# EAGLE design YukariII (EAGLE 6.2)
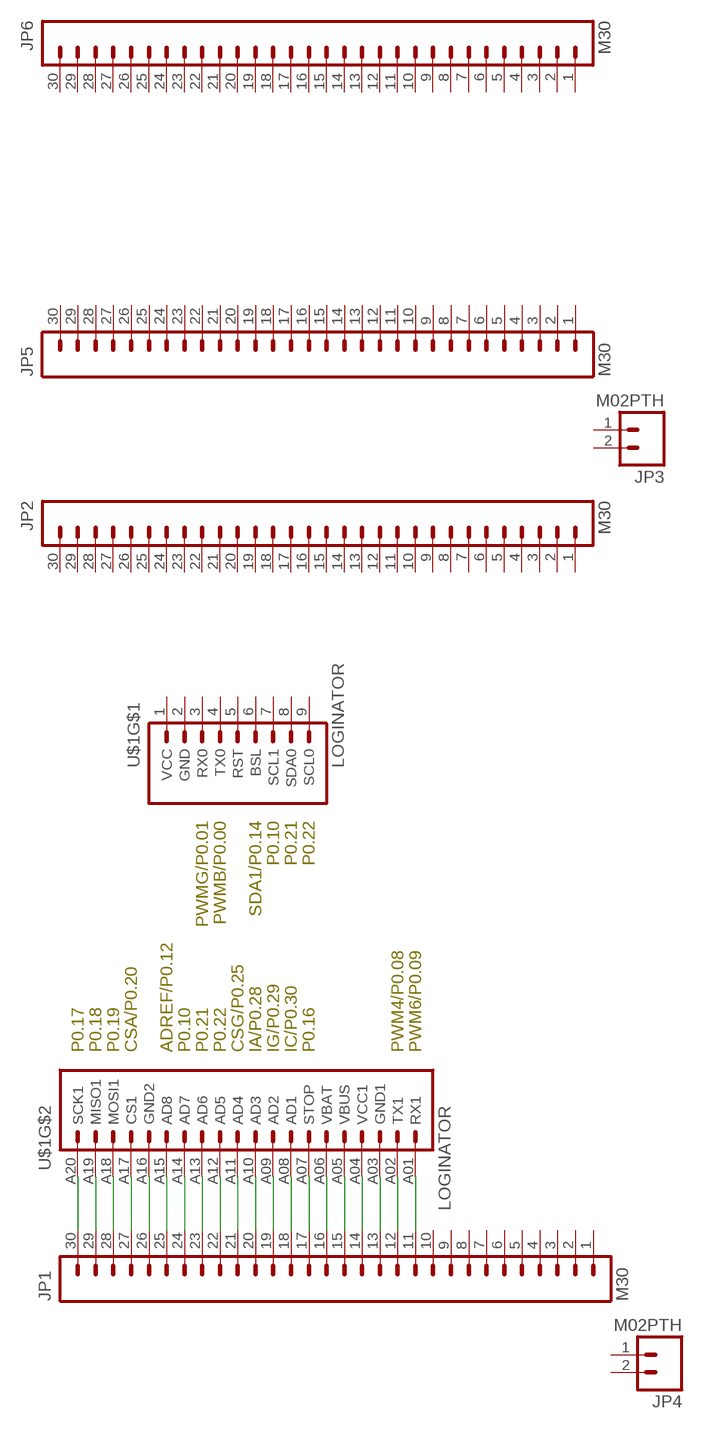
[diagram p0: schematic, sheet 1]

## Parts
JP1  M30  [1X30]
JP2  M30  [1X30]
JP3  M02PTH  [1X02]
JP4  M02PTH  [1X02]
JP5  M30  [1X30]
JP6  M30  [1X30]
U$1  LOGINATOR  [LOGINATOR]

## Nets
N$1: JP1.11 U$1.A01(RX1)
N$2: JP1.12 U$1.A02(TX1)
N$3: JP1.13 U$1.A03(GND1)
N$4: JP1.14 U$1.A04(VCC1)
N$5: JP1.15 U$1.A05(VBUS)
N$6: JP1.16 U$1.A06(VBAT)
N$7: JP1.17 U$1.A07(STOP)
N$8: JP1.18 U$1.A08(AD1)
N$9: JP1.19 U$1.A09(AD2)
N$10: JP1.20 U$1.A10(AD3)
N$11: JP1.21 U$1.A11(AD4)
N$12: JP1.22 U$1.A12(AD5)
N$13: JP1.23 U$1.A13(AD6)
N$14: JP1.24 U$1.A14(AD7)
N$15: JP1.25 U$1.A15(AD8)
N$16: JP1.26 U$1.A16(GND2)
N$17: JP1.27 U$1.A17(CS1)
N$18: JP1.28 U$1.A18(MOSI1)
N$19: JP1.29 U$1.A19(MISO1)
N$20: JP1.30 U$1.A20(SCK1)
Unconnected: JP1.1 JP1.2 JP1.3 JP1.4 JP1.5 JP1.6 JP1.7 JP1.8 JP1.9 JP1.10 JP2.1 JP2.2 JP2.3 JP2.4 JP2.5 JP2.6 JP2.7 JP2.8 JP2.9 JP2.10 JP2.11 JP2.12 JP2.13 JP2.14 JP2.15 JP2.16 JP2.17 JP2.18 JP2.19 JP2.20 JP2.21 JP2.22 JP2.23 JP2.24 JP2.25 JP2.26 JP2.27 JP2.28 JP2.29 JP2.30 JP3.1 JP3.2 JP4.1 JP4.2 JP5.1 JP5.2 JP5.3 JP5.4 JP5.5 JP5.6 JP5.7 JP5.8 JP5.9 JP5.10 JP5.11 JP5.12 JP5.13 JP5.14 JP5.15 JP5.16 JP5.17 JP5.18 JP5.19 JP5.20 JP5.21 JP5.22 JP5.23 JP5.24 JP5.25 JP5.26 JP5.27 JP5.28 JP5.29 JP5.30 JP6.1 JP6.2 JP6.3 JP6.4 JP6.5 JP6.6 JP6.7 JP6.8 JP6.9 JP6.10 JP6.11 JP6.12 JP6.13 JP6.14 JP6.15 JP6.16 JP6.17 JP6.18 JP6.19 JP6.20 JP6.21 JP6.22 JP6.23 JP6.24 JP6.25 JP6.26 JP6.27 JP6.28 JP6.29 JP6.30 U$1.3(RX0) U$1.4(TX0) U$1.5(RST) U$1.6(BSL) U$1.7(SCL1) U$1.8(SDA0) U$1.9(SCL0)

## Power pins joined to a net without a drawn wire
GND: U$1.2(GND)
VCC: U$1.1(VCC)

## Library data of the parts
JP1 JP2 JP5 JP6 = SparkFun-Connectors:M30: 1x30 .1" header
JP3 JP4 = SparkFun-Connectors:M02: Standard 2-pin 0.1" header. Use with - straight break away headers ( PRT-00116) - right angle break away headers (PRT-00553) - swiss pins (PRT-00743) - machine pins (PRT-00117) - female headers (PRT-00115) Molex polarized connector foot print use with: PRT-08233 with associated crimp pins and housings. 2.54_SCREWTERM for use with PRT-10571. 3.5mm Screw Terminal footprints for PRT-08084 5mm Screw Terminal footprints for use with PRT-08433
U$1 = KwanSystems:LOGINATOR

## Net classes
0 default: width 0.152 mm, drill 0.33 mm, clearance 0.152 mm
1 power: width 0.152 mm, drill 0.33 mm, clearance 0.152 mm to class 0, clearance 0.152 mm
2 hv: width 0.152 mm, drill 0.33 mm, clearance 0.152 mm to class 0, clearance 0.152 mm to class 1, clearance 0.152 mm

## Board
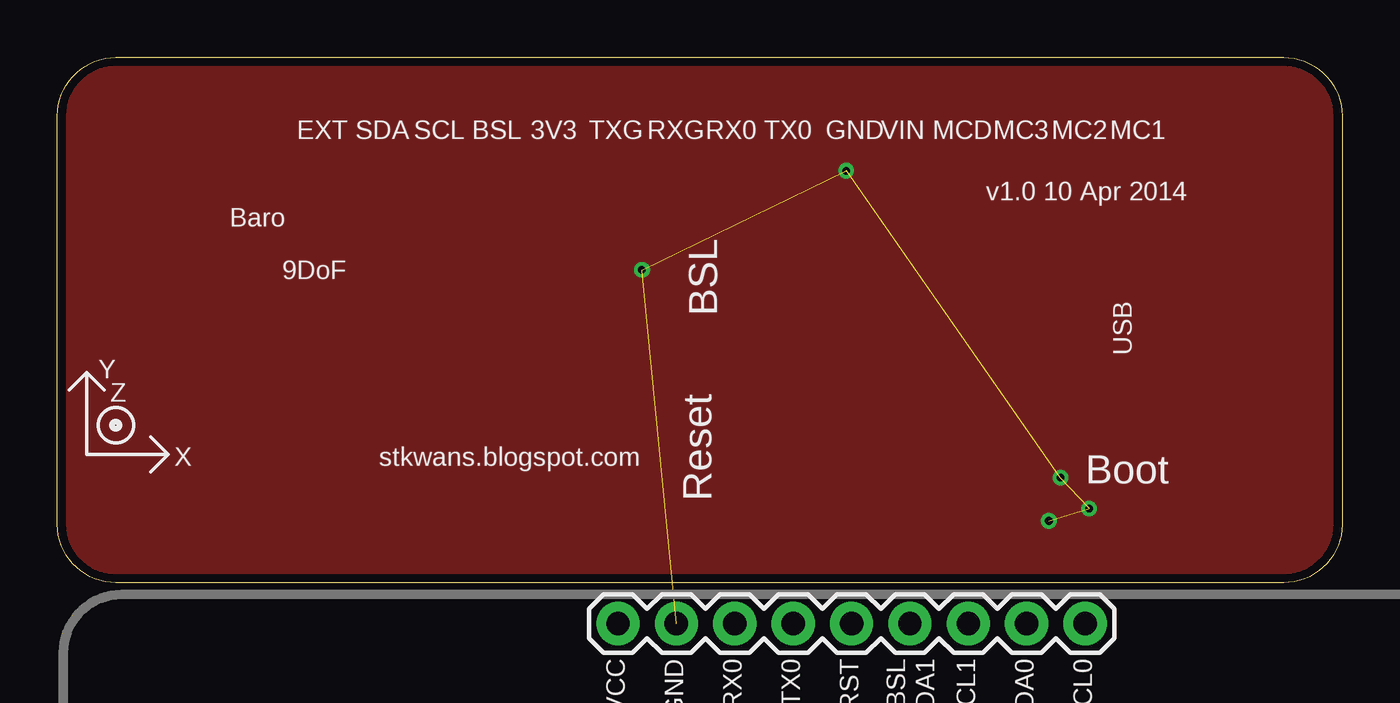
[diagram p1: board, top side]
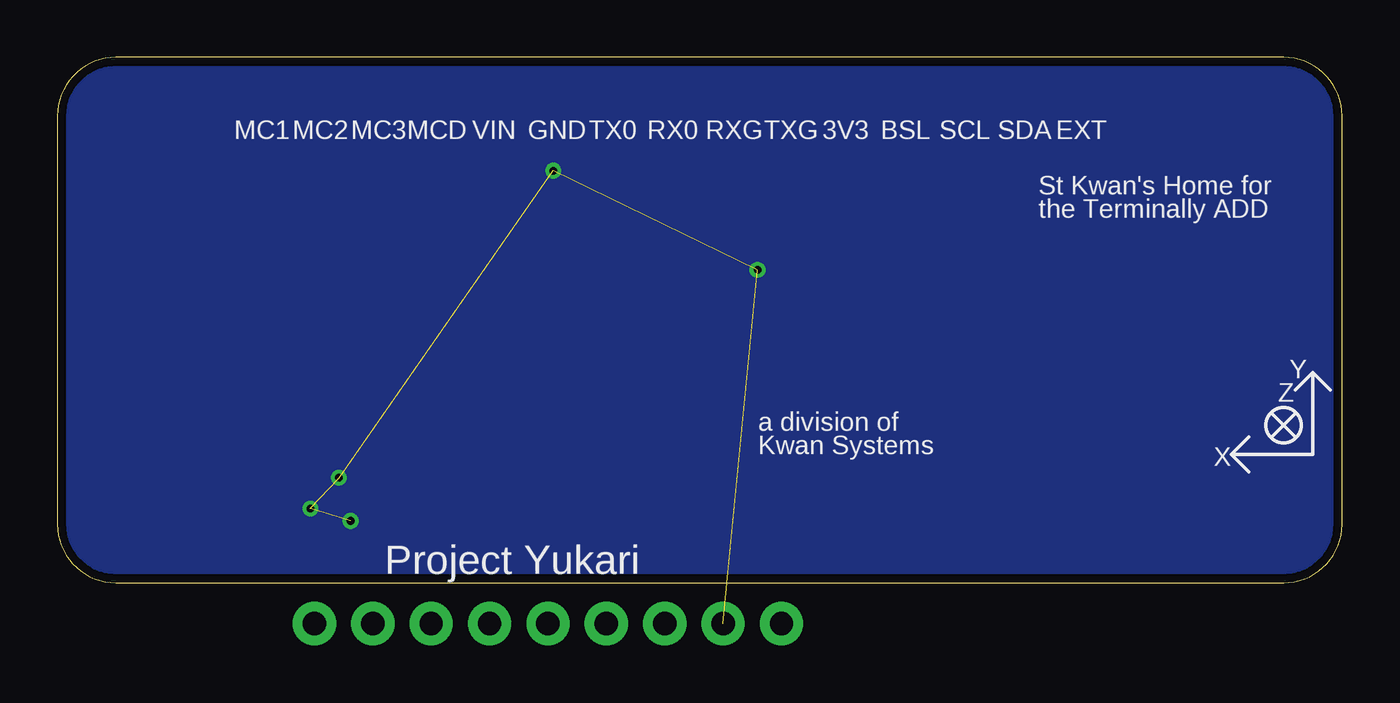
[diagram p2: board, bottom side, seen from below]

Size 55.88 x 22.86 mm. Coordinates in mm from the lower left corner, seen from the top.
Outline: 2.54,22.86 53.34,22.86 arc-90 55.88,20.32 55.88,2.54 arc-90 53.34,0 2.54,0 arc-90 0,2.54 0,20.32 arc-90 2.54,22.86
Copper layers (1*16): Top 0.0356mm / dielectric 1.5011mm / Bottom 0.0356mm
Design rules: minimum track width 6mil, minimum drill 13mil, track to track 6mil, track to pad 6mil, pad to pad 6mil, via to via 6mil, smd to smd 6mil, copper to edge 15mil, drill to drill 6mil, minimum pad ring 7mil, minimum via ring 7mil, stop-mask expansion 4mil, vias tented up to drill 14mil, thermal gap 10mil

### Footprints (pad centres in the part's own frame; a part is rotated, then mirrored left to right if it is on the bottom)
1X30 = drill 1.016 pad 1.88: 1 0,0; 2 2.54,0; 3 5.08,0; 4 7.62,0; 5 10.16,0; 6 12.7,0; 7 15.24,0; 8 17.78,0; 9 20.32,0; 10 22.86,0; 11 25.4,0; 12 27.94,0; 13 30.48,0; 14 33.02,0; 15 35.56,0; 16 38.1,0; 17 40.64,0; 18 43.18,0; 19 45.72,0; 20 48.26,0; 21 50.8,0; 22 53.34,0; 23 55.88,0; 24 58.42,0; 25 60.96,0; 26 63.5,0; 27 66.04,0; 28 68.58,0; 29 71.12,0; 30 73.66,0
1X02 = drill 1.016 pad 1.88: 1 0,0; 2 2.54,0
LOGINATOR = drill 1.016 pad 1.88: 1 24.13,36.83; 2 26.67,36.83; 3 29.21,36.83; 4 31.75,36.83; 5 34.29,36.83; 6 36.83,36.83; 7 39.37,36.83; 8 41.91,36.83; 9 44.45,36.83; A01 54.61,1.27; A02 52.07,1.27; A03 49.53,1.27; A04 46.99,1.27; A05 44.45,1.27; A06 41.91,1.27; A07 39.37,1.27; A08 36.83,1.27; A09 34.29,1.27; A10 31.75,1.27; A11 29.21,1.27; A12 26.67,1.27; A13 24.13,1.27; A14 21.59,1.27; A15 19.05,1.27; A16 16.51,1.27; A18 11.43,1.27; A19 8.89,1.27; A20 6.35,1.27 | drill 1.016 pad 1.88 square: A17 13.97,1.27

### Placement (x,y rotation side)
JP1  1.27,-43.18 0 top  (outside the outline)
JP2  1.27,-50.55 0 top  (outside the outline)
JP3  1.27,-57.91 0 top  (outside the outline)
JP4  1.27,-65.28 0 top  (outside the outline)
JP5  1.27,-72.64 0 top  (outside the outline)
JP6  1.27,-80.01 0 top  (outside the outline)
U$1  0.25,-38.61 0 top
U$4  [AXES]  1.27,5.59 0 top

### Tracks (layer width: path | path; a pad name or v marks a point on that pad's centre or on a via)
GND  (via drill 0.33)  (5 unrouted)
  other vias: 43.64,4.57 44.88,3.23 43.13,2.69 34.32,17.93 25.43,13.61
  pour Top (no thermals): 2.54,22.86 53.34,22.86 55.88,22.86 55.88,2.54 arc-90 53.34,0 2.54,0 arc-90 0,2.54 0,20.32 arc-90
  pour Bottom (no thermals): 2.54,22.86 53.34,22.86 55.88,22.86 55.88,2.54 arc-90 53.34,0 2.54,0 arc-90 0,2.54 0,20.32 arc-90
N$1  (1 unrouted)
N$2  (1 unrouted)
N$3  (1 unrouted)
N$4  (1 unrouted)
N$5  (1 unrouted)
N$6  (1 unrouted)
N$7  (1 unrouted)
N$8  (1 unrouted)
N$9  (1 unrouted)
N$10  (1 unrouted)
N$11  (1 unrouted)
N$12  (1 unrouted)
N$13  (1 unrouted)
N$14  (1 unrouted)
N$15  (1 unrouted)
N$16  (1 unrouted)
N$17  (1 unrouted)
N$18  (1 unrouted)
N$19  (1 unrouted)
N$20  (1 unrouted)

### Text on the board
tPlace: EXT | SDA | SCL | BSL | 3V3 | TXG | RXG | RX0 | TX0 | GND | VIN | MCD | MC3 | MC2 | MC1 | v1.0 10 Apr 2014 | Baro | BSL | 9DoF | USB | stkwans.blogspot.com | Reset | Boot
bPlace: EXT | SDA | SCL | BSL | 3V3 | TXG | RXG | RX0 | TX0 | GND | VIN | MCD | MC3 | MC2 | MC1 | St Kwan's Home for | the Terminally ADD | a division of | Kwan Systems | Project Yukari